# Altium schematic sheet Concentrator and Modem Headers.SchDoc: DaughterBoard Tester
size Letter; DrawnBy: MTAN; Organization: Altium Limited; DocumentNumber: 1; Revision: A; SheetNumber: 1; SheetTotal: 6
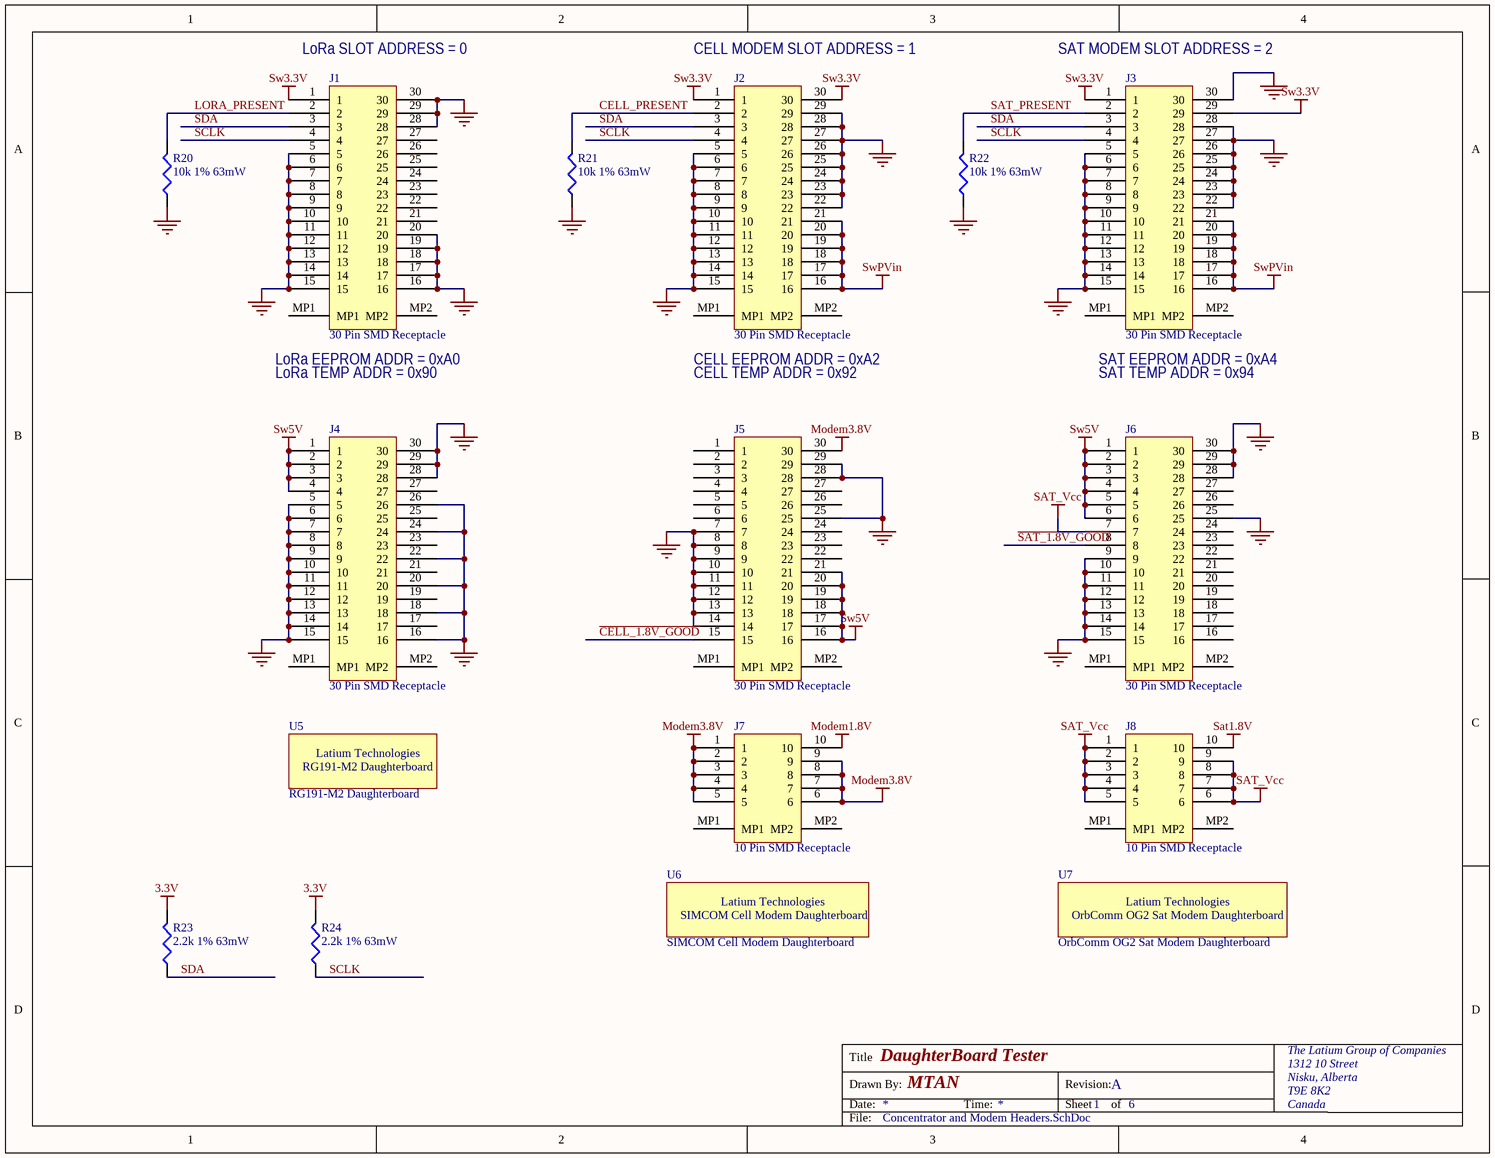
[diagram p0: Concentrator and Modem Headers.SchDoc]

## Parts
J1  30 Pin SMD Receptacle  [10132798-031100LF]
J2  30 Pin SMD Receptacle  [10132798-031100LF]
J3  30 Pin SMD Receptacle  [10132798-031100LF]
J4  30 Pin SMD Receptacle  [10132798-031100LF]
J5  30 Pin SMD Receptacle  [10132798-031100LF]
J6  30 Pin SMD Receptacle  [10132798-031100LF]
J7  10 Pin SMD Receptacle  [10132798-011100LF]
J8  10 Pin SMD Receptacle  [10132798-011100LF]
R20  10k 1% 63mW  [RESC1005L]
R21  10k 1% 63mW  [RESC1005L]
R22  10k 1% 63mW  [RESC1005L]
R23  2.2k 1% 63mW  [RESC1005L]
R24  2.2k 1% 63mW  [RESC1005L]
U5  RG191-M2 Daughterboard  [RG191-M2 LoRa Daughterboard]  (no BOM)
U6  SIMCOM Cell Modem Daughterboard  [SIMCOM Cell Modem Daughterboard]  (no BOM)
U7  OrbComm OG2 Sat Modem Daughterboard  [OrbComm OG2 Daughterboard]  (no BOM)

## Nets
3.3V: R23.2 R24.2
GND: J1.5 J1.6 J1.7 J1.8 J1.9 J1.10 J1.11 J1.12 J1.13 J1.14 J1.15 J1.16 J1.17 J1.18 J1.19 J1.20 J1.28 J1.29 J1.30 J2.5 J2.6 J2.7 J2.8 J2.9 J2.10 J2.11 J2.12 J2.13 J2.14 J2.15 J2.22 J2.23 J2.24 J2.25 J2.26 J2.27 J2.28 J2.29 J3.5 J3.6 J3.7 J3.8 J3.9 J3.10 J3.11 J3.12 J3.13 J3.14 J3.15 J3.22 J3.23 J3.24 J3.25 J3.26 J3.27 J3.28 J3.30 J4.5 J4.6 J4.7 J4.8 J4.9 J4.10 J4.11 J4.12 J4.13 J4.14 J4.15 J4.16 J4.18 J4.20 J4.22 J4.24 J4.26 J4.28 J4.29 J4.30 J5.7 J5.8 J5.9 J5.10 J5.11 J5.12 J5.13 J5.14 J5.25 J5.28 J5.29 J6.9 J6.10 J6.11 J6.12 J6.13 J6.14 J6.15 J6.25 J6.28 J6.29 J6.30 R20.1 R21.1 R22.1
Modem1.8V: J7.10
Modem3.8V: J5.30 J7.1 J7.2 J7.3 J7.4 J7.5 J7.6 J7.7 J7.8 J7.9
Sat1.8V: J8.10
SAT_Vcc: J6.7 J8.1 J8.2 J8.3 J8.4 J8.5 J8.6 J8.7 J8.8 J8.9
Sw3.3V: J1.1 J2.1 J2.30 J3.1 J3.29
Sw5V: J4.1 J4.2 J4.3 J4.4 J5.16 J5.17 J5.18 J5.19 J5.20 J5.21 J6.1 J6.2 J6.3 J6.4 J6.5 J6.6
SwPVin: J2.16 J2.17 J2.18 J2.19 J2.20 J2.21 J3.16 J3.17 J3.18 J3.19 J3.20 J3.21
~{CELL_1.8V_GOOD}: J5.15
CELL_PRESENT: J2.2 R21.2
LORA_PRESENT: J1.2 R20.2
~{SAT_1.8V_GOOD}: J6.8
SAT_PRESENT: J3.2 R22.2
SCLK: J1.4 J2.4 J3.4 R24.1
SDA: J1.3 J2.3 J3.3 R23.1

Not connected (* = marked no-connect by the designer): J1 21 22 23 24 25 26 27 MP1 MP2; J2 MP1 MP2; J3 MP1 MP2; J4 17 19 21 23 25 27 MP1 MP2; J5 1 2 3 4 5 6 22 23 24 26 27 MP1 MP2; J6 16 17 18 19 20 21 22 23 24 26 27 MP1 MP2; J7 MP1 MP2; J8 MP1 MP2

## Notes on the sheet
- (near J1) LoRa SLOT ADDRESS = 0
- (near J2) CELL MODEM SLOT ADDRESS = 1
- (near J3) SAT MODEM SLOT ADDRESS = 2
- (near J1) LoRa EEPROM ADDR = 0xA0
- (near J2) CELL EEPROM ADDR = 0xA2
- (near J3) SAT EEPROM ADDR = 0xA4
- LoRa TEMP ADDR = 0x90
- CELL TEMP ADDR = 0x92
- SAT TEMP ADDR = 0x94
- Title
- Drawn By:
- Date:
- Time:
- Revision:
- Sheet
- of
- The Latium Group of Companies
- 1312 10 Street
- Nisku, Alberta
- T9E 8K2
- Canada
- File:
- (in symbol OrbComm OG2 Sat Modem Daughterboard) Latium Technologies
- (in symbol RG191-M2 Daughterboard) Latium Technologies
- (in symbol SIMCOM Cell Modem Daughterboard) Latium Technologies

## Library data of the parts
J1-J6 = Amphenol 30 Pos BergStak Plug: CONN RCPT 30POS SMD GOLD; Manufacturer: Amphenol ICC (FCI); Note: Mates with 10132797-031100LF plug 3mm between board height; Value: 30 Pin SMD Receptacle; Manufacturer Part Number: 10132798-031100LF; Supplier 1: Digi-Key; Supplier 1 Part Number: 609-5030-1-ND
J7 J8 = Amphenol 10 Pos BergStak Plug: CONN RCPT 10POS SMD GOLD; Manufacturer: Amphenol ICC (FCI); Note: Mates with 10132797-011100LF plug 3mm between board height; Value: 10 Pin SMD Receptacle; Manufacturer Part Number: 10132798-011100LF; Supplier 1: Digi-Key; Supplier 1 Part Number: 609-5026-1-ND
R20-R24 = Res3: Resistor
  R20-R22: Value: 10k 1% 63mW
  R23 R24: Value: 2.2k 1% 63mW
U5 = RG191-M2 Daughterboard: Value: RG191-M2 Daughterboard
U6 = SIMCOM Cell Modem Daughterboard: Value: SIMCOM Cell Modem Daughterboard
U7 = OrbComm OG2 Sat Modem Daughterboard: Value: OrbComm OG2 Sat Modem Daughterboard